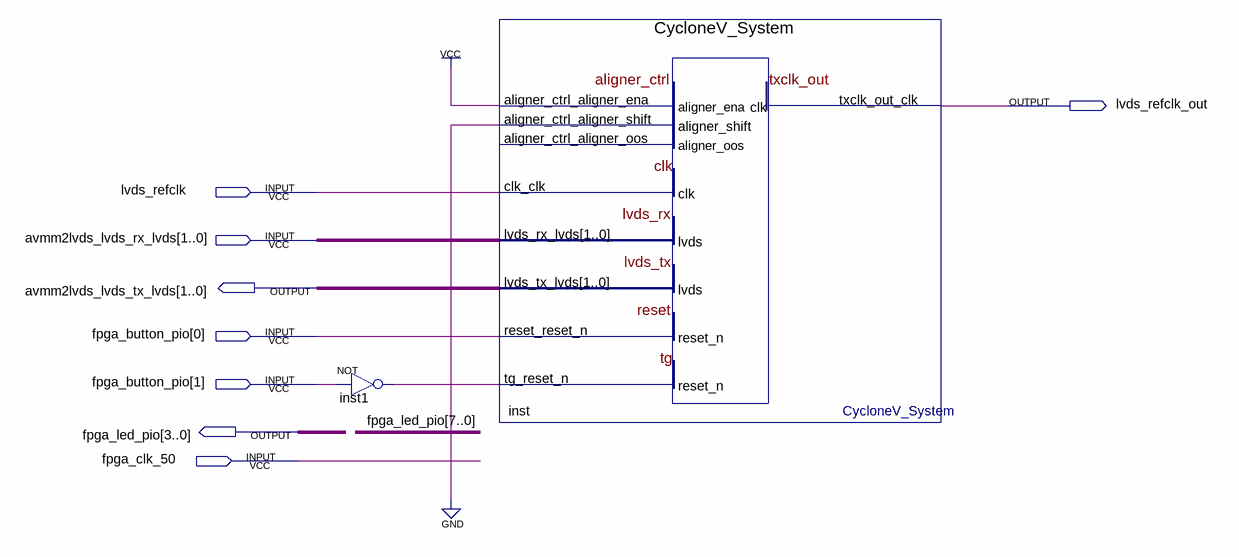
[diagram p0: schematic sheet]
// Quartus schematic CycloneV_AVMM2LVDS.bdf as structural Verilog: 2 symbols, 8 pins
module CycloneV_AVMM2LVDS (
  input  lvds_refclk,
  input  [1:0] avmm2lvds_lvds_rx_lvds,
  input  [1:0] fpga_button_pio,
  input  fpga_clk_50,
  output lvds_refclk_out,
  output [1:0] avmm2lvds_lvds_tx_lvds,
  output [3:0] fpga_led_pio
);

  wire inst1_out;

  not inst1 (inst1_out, fpga_button_pio[1]);
  CycloneV_System inst (
    .aligner_ctrl_aligner_ena(1'b1), .aligner_ctrl_aligner_shift(1'b0), .clk_clk(lvds_refclk),
    .lvds_rx_lvds(avmm2lvds_lvds_rx_lvds), .reset_reset_n(fpga_button_pio[0]), .tg_reset_n(inst1_out),
    .lvds_tx_lvds(avmm2lvds_lvds_tx_lvds), .txclk_out_clk(lvds_refclk_out));  // open: aligner_ctrl_aligner_oos
endmodule
